# EasyEDA schematic demo_74HC595_Shift_register.json
TITLE: Demo 74HC595 Shift Register; REV: 1.0; Date: 2020-02-20; Sheet: 1/1; Drawn By: effevee; Company: VergoSoft Ltd
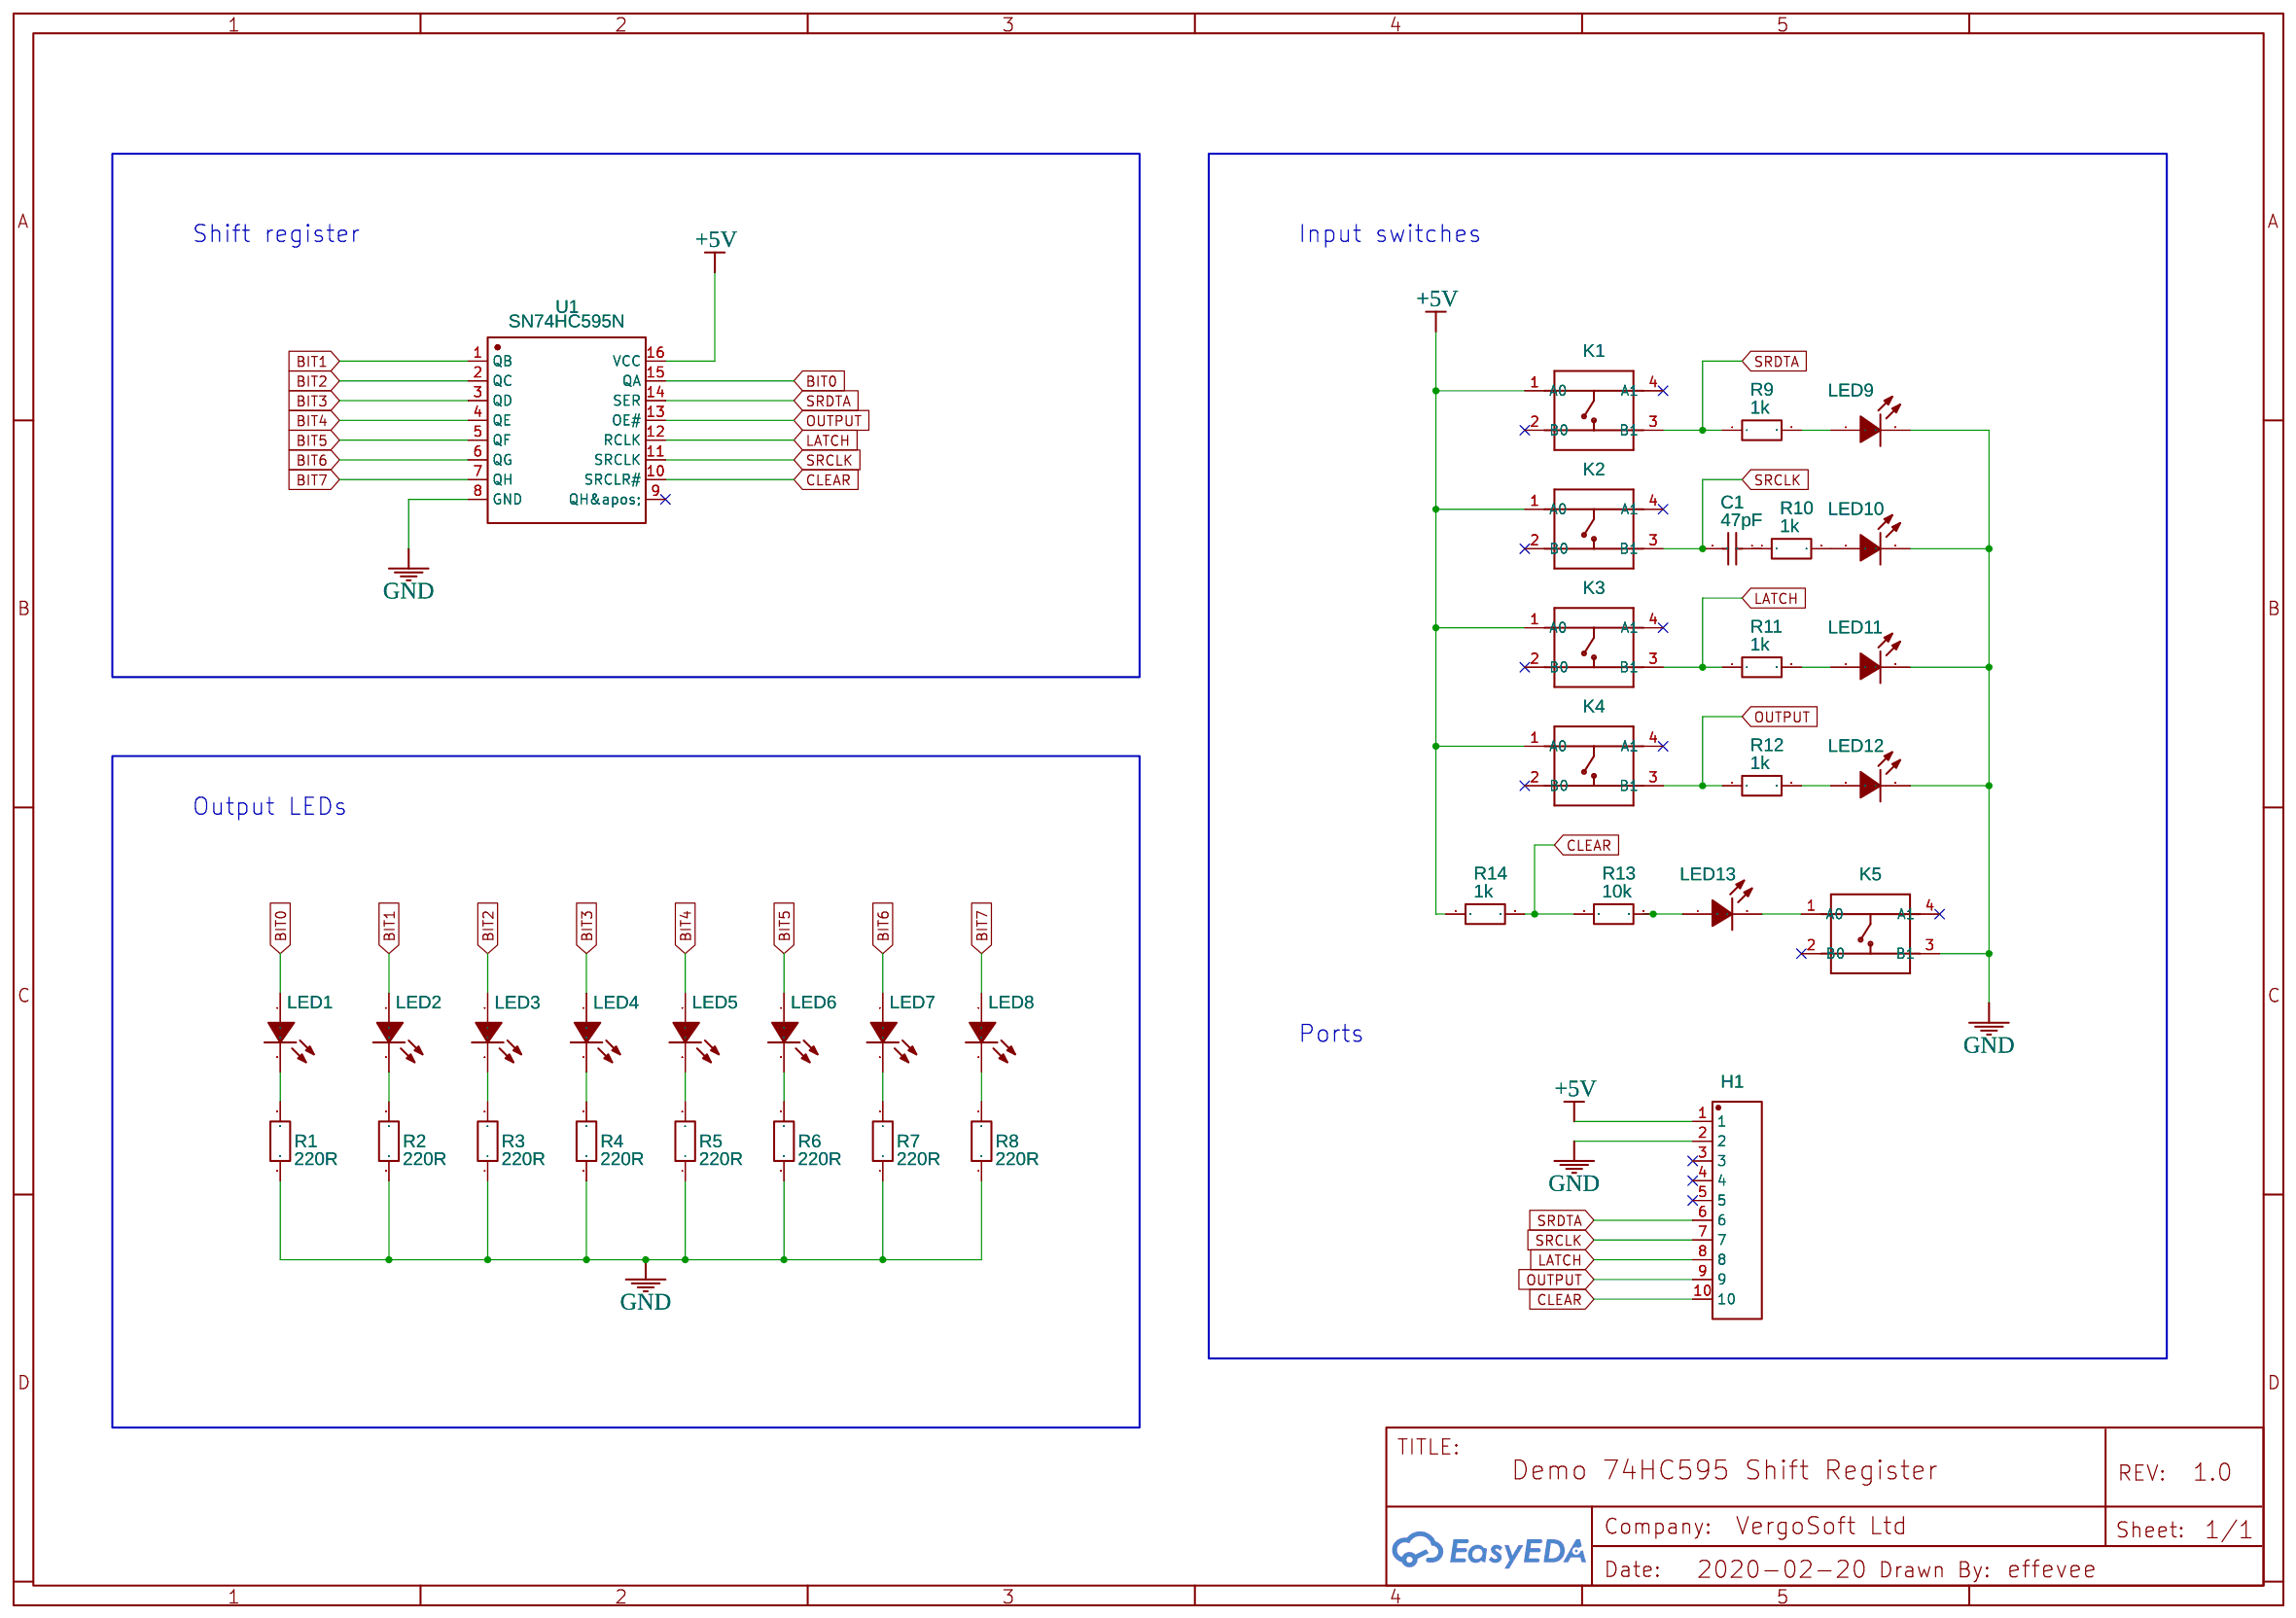
[diagram p0: schematic sheet]

## Parts
C1  47pF  [RAD-0.1]
H1  Header-Male-2.54_1x10  [HDR-TH_10P-P2.54-V]
K1  DIP-SWITCH-TACTILE-SPST-NO_TS-1109(4P-D6.0MM)TS-1109  [SW4-6.0X6.0X5.0MM]
K2  DIP-SWITCH-TACTILE-SPST-NO_TS-1109(4P-D6.0MM)TS-1109  [SW4-6.0X6.0X5.0MM]
K3  DIP-SWITCH-TACTILE-SPST-NO_TS-1109(4P-D6.0MM)TS-1109  [SW4-6.0X6.0X5.0MM]
K4  DIP-SWITCH-TACTILE-SPST-NO_TS-1109(4P-D6.0MM)TS-1109  [SW4-6.0X6.0X5.0MM]
K5  DIP-SWITCH-TACTILE-SPST-NO_TS-1109(4P-D6.0MM)TS-1109  [SW4-6.0X6.0X5.0MM]
LED1  204-10SURD/S530-A3  [LED-3MM/2.54]
LED2  204-10SURD/S530-A3  [LED-3MM/2.54]
LED3  204-10SURD/S530-A3  [LED-3MM/2.54]
LED4  204-10SURD/S530-A3  [LED-3MM/2.54]
LED5  204-10SURD/S530-A3  [LED-3MM/2.54]
LED6  204-10SURD/S530-A3  [LED-3MM/2.54]
LED7  204-10SURD/S530-A3  [LED-3MM/2.54]
LED8  204-10SURD/S530-A3  [LED-3MM/2.54]
LED9  204-10SURD/S530-A3  [LED-3MM/2.54]
LED10  204-10SURD/S530-A3  [LED-3MM/2.54]
LED11  204-10SURD/S530-A3  [LED-3MM/2.54]
LED12  204-10SURD/S530-A3  [LED-3MM/2.54]
LED13  204-10SURD/S530-A3  [LED-3MM/2.54]
R1  220R  [AXIAL-0.3]
R2  220R  [AXIAL-0.3]
R3  220R  [AXIAL-0.3]
R4  220R  [AXIAL-0.3]
R5  220R  [AXIAL-0.3]
R6  220R  [AXIAL-0.3]
R7  220R  [AXIAL-0.3]
R8  220R  [AXIAL-0.3]
R9  1k  [AXIAL-0.3]
R10  1k  [AXIAL-0.3]
R11  1k  [AXIAL-0.3]
R12  1k  [AXIAL-0.3]
R13  10k  [AXIAL-0.3]
R14  1k  [AXIAL-0.3]
U1  SN74HC595N  [DIP-16_L19.8-W6.5-P2.54-LS7.6-BL]

## Library data of the parts
C1 = 22pF: Voltage: 50V; Tolerance: ±10%; Supplier Part: C9316; Supplier: LCSC; Manufacturer: ReliaPro; Manufacturer Part: 22pf/50V 10%
H1 = Header-Male-2.54_1x10: Supplier: LCSC; Manufacturer Part: Headers  Pins2.54mm1*10P; image: http://image.lceda.cn/szlcsc/C57369.jpg; Supplier Part: C57369
K1-K5 = DIP-SWITCH-TACTILE-SPST-NO_TS-1109(4P-D6.0MM)TS-1109: 311020024
LED1-LED13 = 204-10SURD/S530-A3: Supplier: LCSC; Manufacturer: EVERLIGHT; Supplier Part: C99772
R1-R14 = Res_AXIAL-0.3(1/8W)_EU
U1 = SN74HC595N: Supplier: LCSC; Manufacturer: TI; image: //image.lceda.cn/szlcsc/C78711.jpg; Supplier Part: C78711

## Nets
+5V: H1.1 K1.1(A0) K2.1(A0) K3.1(A0) K4.1(A0) R14.1 U1.16(VCC)
GND: H1.2 K5.3(B1) LED9.2(K) LED10.2(K) LED11.2(K) LED12.2(K) R1.1 R2.1 R3.1 R4.1 R5.1 R6.1 R7.1 R8.1 U1.8(GND)
BIT0: LED1.1(A) U1.15(QA)
BIT1: LED2.1(A) U1.1(QB)
BIT2: LED3.1(A) U1.2(QC)
BIT3: LED4.1(A) U1.3(QD)
BIT4: LED5.1(A) U1.4(QE)
BIT5: LED6.1(A) U1.5(QF)
BIT6: LED7.1(A) U1.6(QG)
BIT7: LED8.1(A) U1.7(QH)
CLEAR: H1.10 R13.1 R14.2 U1.10(SRCLR#)
LATCH: H1.8 K3.3(B1) R11.1 U1.12(RCLK)
OUTPUT: H1.9 K4.3(B1) R12.1 U1.13(OE#)
SRCLK: C1.1 H1.7 K2.3(B1) U1.11(SRCLK)
SRDTA: H1.6 K1.3(B1) R9.1 U1.14(SER)
Net-(C1-2): C1.2 R10.1
Net-(K5-1): K5.1(A0) LED13.2(K)
Net-(LED1-2): LED1.2(K) R1.2
Net-(LED2-2): LED2.2(K) R2.2
Net-(LED3-2): LED3.2(K) R3.2
Net-(LED4-2): LED4.2(K) R4.2
Net-(LED5-2): LED5.2(K) R5.2
Net-(LED6-2): LED6.2(K) R6.2
Net-(LED7-2): LED7.2(K) R7.2
Net-(LED8-2): LED8.2(K) R8.2
Net-(LED9-1): LED9.1(A) R9.2
Net-(LED10-1): LED10.1(A) R10.2
Net-(LED11-1): LED11.1(A) R11.2
Net-(LED12-1): LED12.1(A) R12.2
Net-(LED13-1): LED13.1(A) R13.2

Not connected (* = marked no-connect by the designer): H1 3* 4* 5*; K1 2(B0)* 4(A1)*; K2 2(B0)* 4(A1)*; K3 2(B0)* 4(A1)*; K4 2(B0)* 4(A1)*; K5 2(B0)* 4(A1)*; U1 9(QH')*

## Notes on the sheet
- Shift register
- Input switches
- Output LEDs
- Ports
